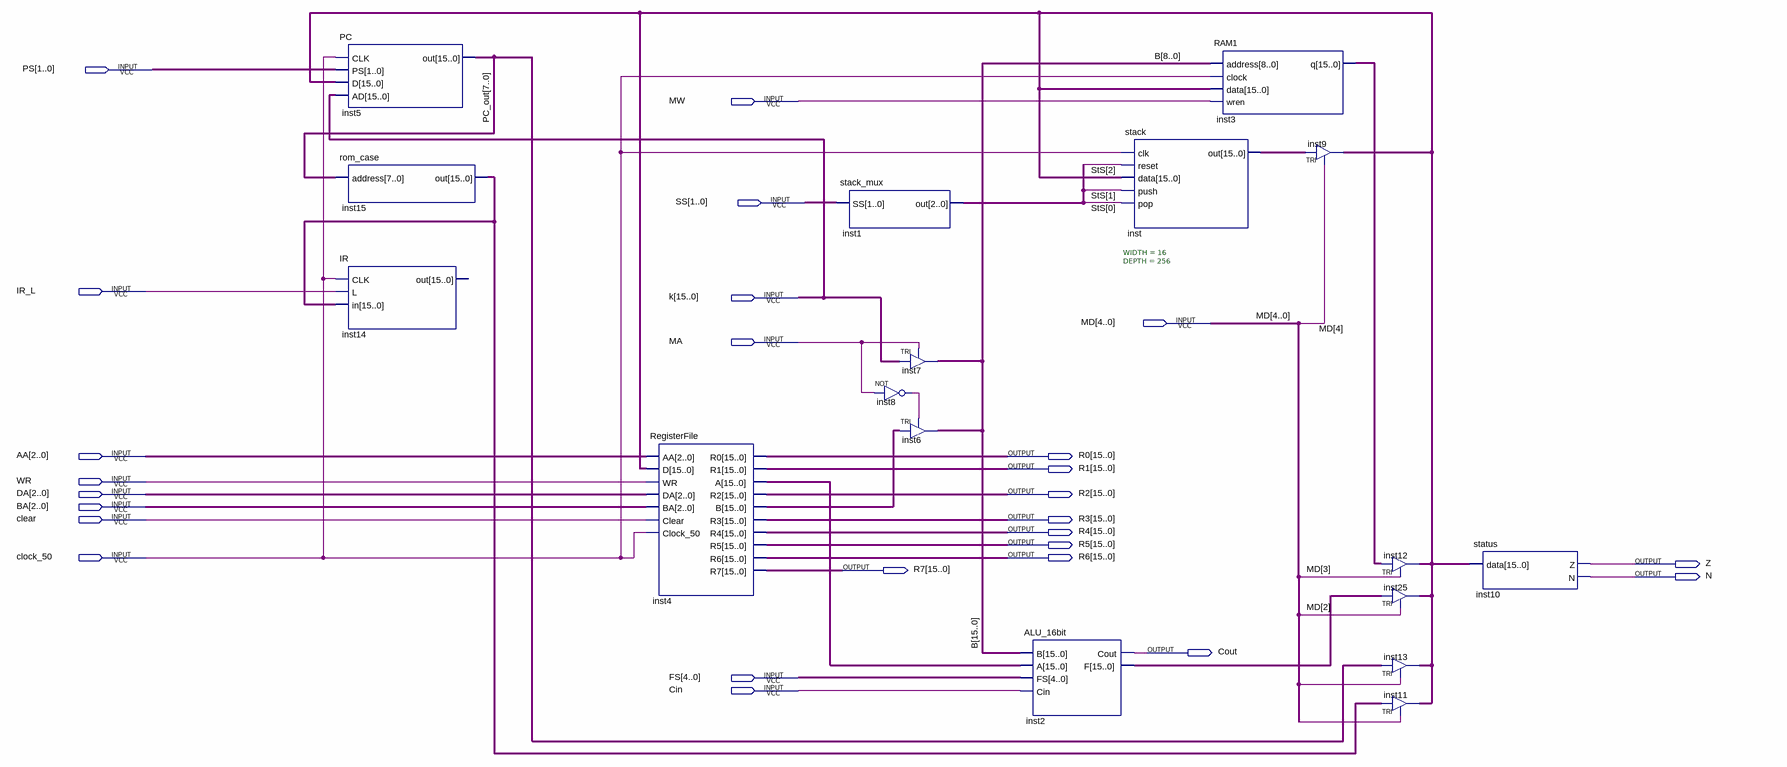
[diagram p0: schematic sheet]
// Quartus schematic Top_Level_ModelSim.bdf as structural Verilog: 17 symbols, 26 pins
module Top_Level_ModelSim (
  input  [1:0] PS,
  input  MW,
  input  [1:0] SS,
  input  IR_L,
  input  [15:0] k,
  input  [4:0] MD,
  input  MA,
  input  [2:0] AA,
  input  WR,
  input  [2:0] DA,
  input  [2:0] BA,
  input  clear,
  input  clock_50,
  input  [4:0] FS,
  input  Cin,
  output [15:0] R0,
  output [15:0] R1,
  output [15:0] R2,
  output [15:0] R3,
  output [15:0] R4,
  output [15:0] R5,
  output [15:0] R6,
  output Z,
  output [15:0] R7,
  output N,
  output Cout
);

  wire inst8_out;
  wire [2:0] StS;
  wire [15:0] B, inst2_f, inst3_q, inst4_a, inst4_b, inst9_out, inst15_out, inst_out, PC_out;

  PC inst5 (.CLK(clock_50), .PS(PS), .D(inst9_out), .AD(k), .out(PC_out));
  rom_case inst15 (.address(PC_out[7:0]), .out(inst15_out));
  IR inst14 (.CLK(clock_50), .L(IR_L), .in(inst15_out));  // open: out
  RegisterFile inst4 (
    .AA(AA), .D(inst9_out), .WR(WR), .DA(DA), .BA(BA), .Clear(clear), .Clock_50(clock_50), .R0(R0), .R1(R1),
    .A(inst4_a), .R2(R2), .B(inst4_b), .R3(R3), .R4(R4), .R5(R5), .R6(R6), .R7(R7));
  stack_mux inst1 (.SS(SS), .out(StS));
  TRI inst7[15:0] (.IN(k), .OE(MA), .OUT(B));
  not inst8 (inst8_out, MA);
  TRI inst6[15:0] (.IN(inst4_b), .OE(inst8_out), .OUT(B));
  ALU_16bit inst2 (.B(B), .A(inst4_a), .FS(FS), .Cin(Cin), .Cout(Cout), .F(inst2_f));
  stack #(.WIDTH(16), .DEPTH(256)) inst (
    .clk(clock_50), .reset(StS[2]), .data(inst9_out), .push(StS[1]), .pop(StS[0]), .out(inst_out));
  RAM1 inst3 (.address(B[8:0]), .clock(clock_50), .data(inst9_out), .wren(MW), .q(inst3_q));
  TRI inst9[15:0] (.IN(inst_out), .OE(MD[4]), .OUT(inst9_out));
  TRI inst12[15:0] (.IN(inst3_q), .OE(MD[3]), .OUT(inst9_out));
  TRI inst25[15:0] (.IN(inst2_f), .OE(MD[2]), .OUT(inst9_out));
  TRI inst13[15:0] (.IN(PC_out), .OE(MD[1]), .OUT(inst9_out));
  TRI inst11[15:0] (.IN(inst15_out), .OE(MD[0]), .OUT(inst9_out));
  status inst10 (.data(inst9_out), .Z(Z), .N(N));
endmodule
